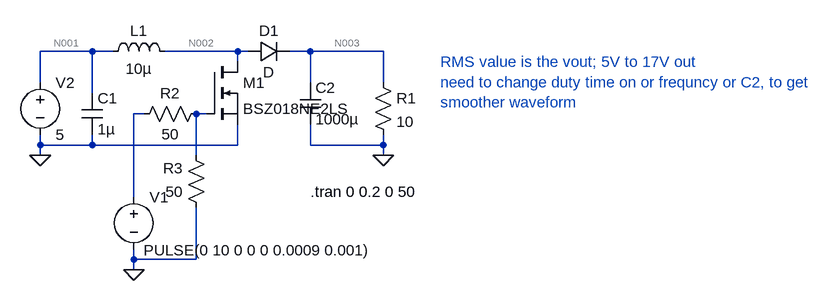
[diagram p0: schematic lecture_5_boost_converter.asc]
lecture_5_boost_converter.asc, the LTspice schematic file:
Version 4
SHEET 1 1040 680
WIRE -208 80 -288 80
WIRE -176 80 -208 80
WIRE 16 80 -96 80
WIRE 32 80 16 80
WIRE 128 80 96 80
WIRE 240 80 128 80
WIRE 16 96 16 80
WIRE -288 128 -288 80
WIRE 128 128 128 80
WIRE 240 128 240 80
WIRE -208 144 -208 80
WIRE -128 176 -144 176
WIRE -32 176 -48 176
WIRE -288 224 -288 208
WIRE -208 224 -208 208
WIRE -208 224 -288 224
WIRE 16 224 16 192
WIRE 16 224 -208 224
WIRE 128 224 128 192
WIRE 240 224 240 208
WIRE 240 224 128 224
WIRE -288 240 -288 224
WIRE -48 240 -48 176
WIRE 240 240 240 224
WIRE -144 304 -144 176
WIRE -144 400 -144 384
WIRE -48 400 -48 320
WIRE -48 400 -144 400
WIRE -144 416 -144 400
FLAG -288 240 0
FLAG 240 240 0
FLAG -144 416 0
SYMBOL voltage -144 288 R0
WINDOW 3 15 98 Left 2
WINDOW 123 24 124 Left 2
WINDOW 39 0 0 Left 0
SYMATTR Value PULSE(0 10 0 0 0 0.0009 0.001)
SYMATTR InstName V1
SYMBOL ind -192 96 R270
WINDOW 0 32 56 VTop 2
WINDOW 3 5 56 VBottom 2
SYMATTR InstName L1
SYMATTR Value 10µ
SYMBOL res 224 112 R0
SYMATTR InstName R1
SYMATTR Value 10
SYMBOL cap -224 144 R0
SYMATTR InstName C1
SYMATTR Value 1µ
SYMBOL cap 112 128 R0
SYMATTR InstName C2
SYMATTR Value 1000µ
SYMBOL nmos -32 96 R0
SYMATTR InstName M1
SYMATTR Value BSZ018NE2LS
SYMBOL res -32 160 R90
WINDOW 0 0 56 VBottom 2
WINDOW 3 32 56 VTop 2
SYMATTR InstName R2
SYMATTR Value 50
SYMBOL res -32 336 R180
WINDOW 0 36 76 Left 2
WINDOW 3 36 40 Left 2
SYMATTR InstName R3
SYMATTR Value 50
SYMBOL voltage -288 112 R0
WINDOW 123 0 0 Left 0
WINDOW 39 0 0 Left 0
SYMATTR InstName V2
SYMATTR Value 5
SYMBOL diode 32 96 R270
WINDOW 0 32 32 VTop 2
WINDOW 3 0 32 VBottom 2
SYMATTR InstName D1
TEXT 128 296 Left 2 !.tran 0 0.2 0 50
TEXT 328 96 Left 2 ;RMS value is the vout; 5V to 17V out\nneed to change duty time on or frequncy or C2, to get\nsmoother waveform

The netlist it stands for:
* lecture_5_boost_converter.asc
V1 N004 0 PULSE(0 10 0 0 0 0.0009 0.001)
L1 N001 N002 10µ
R1 N003 0 10
C1 N001 0 1µ
C2 N003 0 1000µ
M1 N002 N005 0 0 BSZ018NE2LS
R2 N005 N004 50
R3 0 N005 50
V2 N001 0 5
D1 N002 N003 D
.model D D
.lib standard.dio
.model NMOS NMOS
.model PMOS PMOS
.lib standard.mos
.tran 0 0.2 0 50
* RMS value is the vout; 5V to 17V out
* need to change duty time on or frequncy or C2, to get
* smoother waveform
.backanno
.end

* Results of the author's LTspice run, read from the files saved beside the schematic
* Operating Point, zero values left out:
*   V(n001) = 5 V
*   V(n002) = 5 V
*   V(n003) = 4.188 V
*   Id(M1) = 35.81 pA
*   Is(M1) = -35.81 pA
*   I(D1) = 418.8 mA
*   I(L1) = 418.8 mA
*   I(R1) = 418.8 mA
*   I(V2) = -418.8 mA